# EAGLE schematic brick_i2c_3axis_lis331hh (EAGLE 7.2.0)
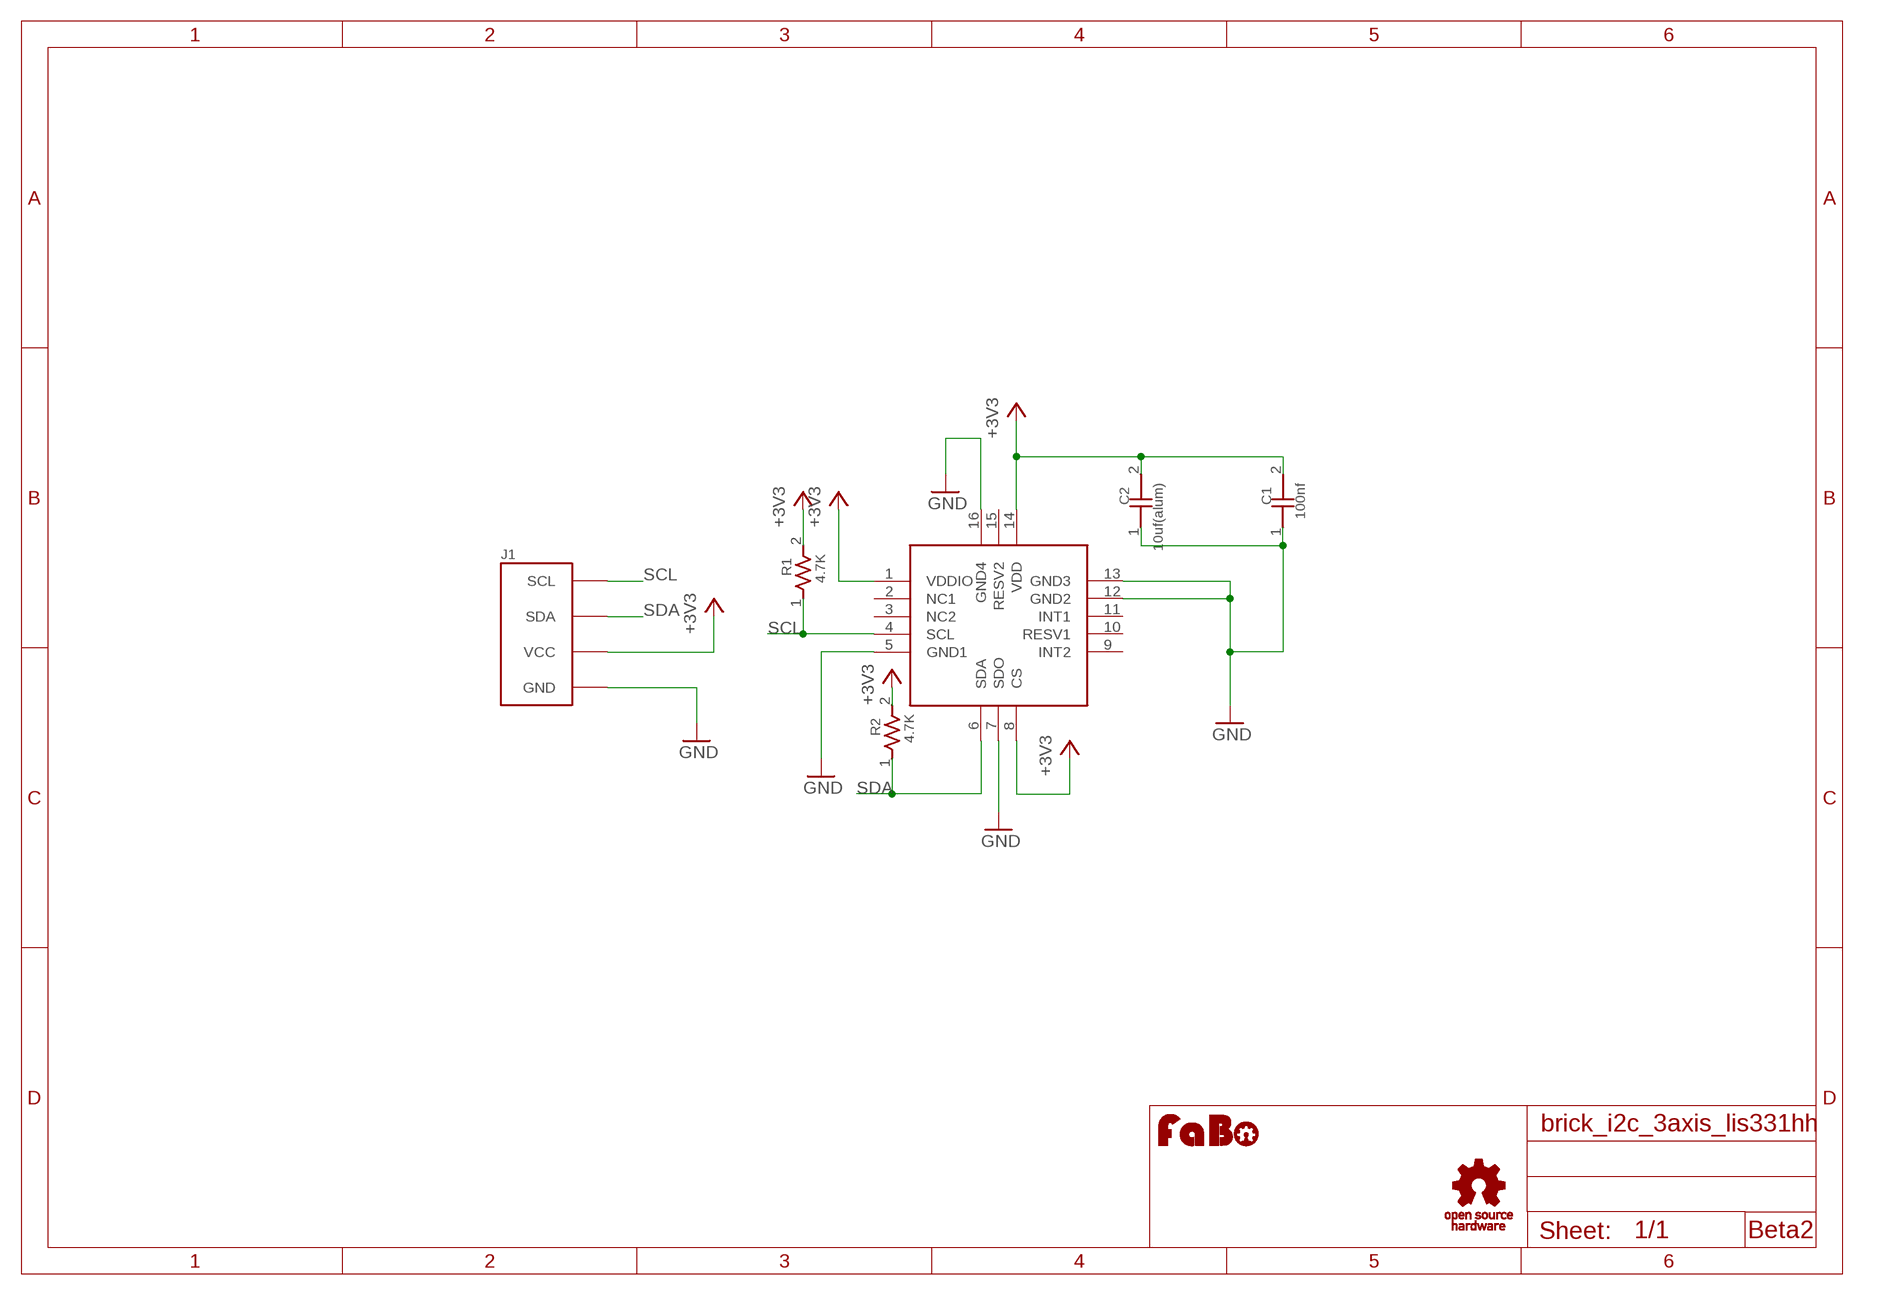
[diagram p0: schematic, sheet 1]

## Parts
C1  100nf  CAPACITOR0603  [0603]
C2  10uf(alum)  CAPACITOR0603  [0603]
J1  BRICK_I2C  [BRICK_I2C]
R1  4.7K  RESISTOR0603  [0603]
R2  4.7K  RESISTOR0603  [0603]
U$1  ST-LIS331HH  [ST-LIS331HH]
U$3  LOGO_OSHW_T-M  [LOGO_OSHW_T_M]
U$4  LOGO_FABO-M  [LOGO_FABO_M]

## Nets
+3V3: C1.2 C2.2 J1.VCC R1.2 R2.2 U$1.1(VDDIO) U$1.8(CS) U$1.14(VDD)
GND: C1.1 C2.1 J1.GND U$1.5(GND1) U$1.7(SDO) U$1.12(GND2) U$1.13(GND3) U$1.16(GND4)
SCL: J1.SCL R1.1 U$1.4(SCL)
SDA: J1.SDA R2.1 U$1.6(SDA)
Unconnected: U$1.2(NC1) U$1.3(NC2) U$1.9(INT2) U$1.10(RESV1) U$1.11(INT1) U$1.15(RESV2)

## Notes on the sheet
- Beta2

## Library data of the parts
C1 C2 = GClue-Capacitor:CAPACITOR
J1 = gclue:BRICK_I2C: FaBo Brick 4pin(I2C)
R1 R2 = GClue-Resistors:RESISTOR
U$1 = GClue-Mems:ST-LIS331HH
U$3 = gclue:LOGO_OSHW_T
U$4 = FaBo:LOGO_FABO